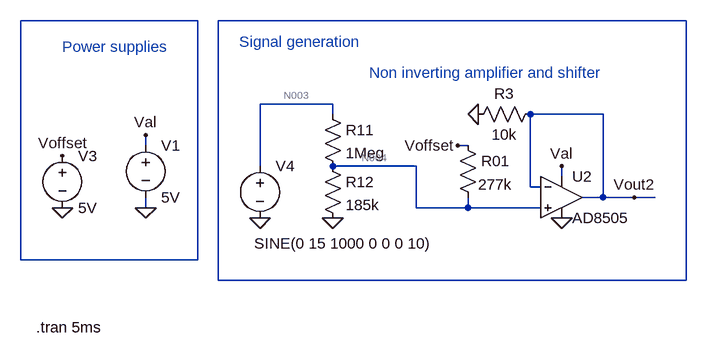
[diagram p0: schematic scope_front_end.asc]
scope_front_end.asc, the LTspice schematic file:
Version 4
SHEET 1 1940 916
WIRE 208 -80 -64 -80
WIRE 960 -80 240 -80
WIRE 416 48 304 48
WIRE 416 64 416 48
WIRE 832 64 720 64
WIRE 128 112 128 96
WIRE 624 112 608 112
WIRE 304 144 304 48
WIRE 544 144 416 144
WIRE 768 160 768 144
WIRE 720 176 720 64
WIRE 736 176 720 176
WIRE 832 192 832 64
WIRE 832 192 800 192
WIRE 880 192 832 192
WIRE 912 192 880 192
WIRE 128 208 128 192
WIRE 544 208 544 144
WIRE 624 208 624 192
WIRE 624 208 544 208
WIRE 736 208 624 208
WIRE -64 288 -64 -80
WIRE 208 288 208 -80
WIRE 208 288 -64 288
WIRE 240 320 240 -80
WIRE 960 320 960 -80
WIRE 960 320 240 320
FLAG 128 208 0
FLAG 128 96 Val
FLAG 0 128 Voffset
FLAG 0 208 0
FLAG 304 224 0
FLAG 416 224 0
FLAG 880 192 Vout2
FLAG 768 224 0
FLAG 768 144 Val
FLAG 640 64 0
FLAG 608 112 Voffset
SYMBOL voltage 128 96 R0
WINDOW 123 0 0 Left 0
WINDOW 39 0 0 Left 0
SYMATTR InstName V1
SYMATTR Value 5V
SYMBOL voltage 0 112 R0
WINDOW 123 0 0 Left 0
WINDOW 39 0 0 Left 0
SYMATTR InstName V3
SYMATTR Value 5V
SYMBOL voltage 304 128 R0
WINDOW 123 0 0 Left 0
WINDOW 39 0 0 Left 0
WINDOW 3 -9 135 Left 2
SYMATTR InstName V4
SYMATTR Value SINE(0 15 1000 0 0 0 10)
SYMBOL res 400 48 R0
SYMATTR InstName R11
SYMATTR Value 1Meg
SYMBOL res 400 128 R0
SYMATTR InstName R12
SYMATTR Value 185k
SYMBOL res 608 96 R0
WINDOW 3 32 76 Left 2
SYMATTR Value 277k
SYMATTR InstName R01
SYMBOL res 736 48 R90
WINDOW 0 0 56 VBottom 2
WINDOW 3 32 56 VTop 2
SYMATTR InstName R3
SYMATTR Value 10k
SYMBOL Opamps\\AD8505 768 128 R0
SYMATTR InstName U2
TEXT 272 -48 Left 2 ;Signal generation
TEXT -40 392 Left 2 !.tran 5ms
TEXT 0 -40 Left 2 ;Power supplies
TEXT 472 0 Left 2 ;Non inverting amplifier and shifter

The netlist it stands for:
* scope_front_end.asc
V1 Val 0 5V
V3 Voffset 0 5V
V4 N003 0 SINE(0 15 1000 0 0 0 10)
R11 N003 N004 1Meg
R12 N004 0 185k
R01 Voffset N004 277k
R3 Vout2 0 10k
XU2 N004 Vout2 Val 0 Vout2 AD8505  ; pins In+ In- V+ V- OUT
* Signal generation
.tran 5ms
* Power supplies
* Non inverting amplifier and shifter
.backanno
.end

* Results of the author's LTspice run, read from the files saved beside the schematic
* Operating Point, zero values left out:
*   V(val) = 5 V
*   V(voffset) = 5 V
*   V(n004) = 1.802 V
*   V(vout2) = 1.803 V
*   I(R3) = 180.3 µA
*   I(R01) = 11.54 µA
*   I(R12) = 9.742 µA
*   I(R11) = -1.802 µA
*   I(V4) = 1.802 µA
*   I(V3) = -11.54 µA
*   I(V1) = -189.7 µA
*   Ix(u2:1) = 1.5 pA
*   Ix(u2:2) = -1.5 pA
*   Ix(u2:99) = 189.7 µA
*   Ix(u2:50) = -9.435 µA
*   Ix(u2:45) = -180.3 µA
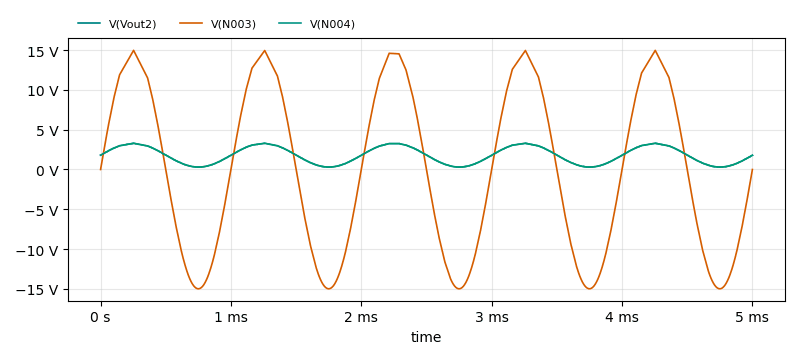
[diagram p1: Transient Analysis of scope_front_end.asc, plotted from the saved traces]
* Transient Analysis, 1 run:
*   V(Vout2): min 305.4 mV, max 3.298 V, average 1.794 V, rms 2.078 V, last 1.784 V
*   V(N003): min -15 V, max 14.98 V, average -89.96 mV, rms 10.52 V, last 0 V
*   V(N004): min 304.9 mV, max 3.298 V, average 1.793 V, rms 2.078 V, last 1.798 V